# Altium project LED_Controller.PrjPcb
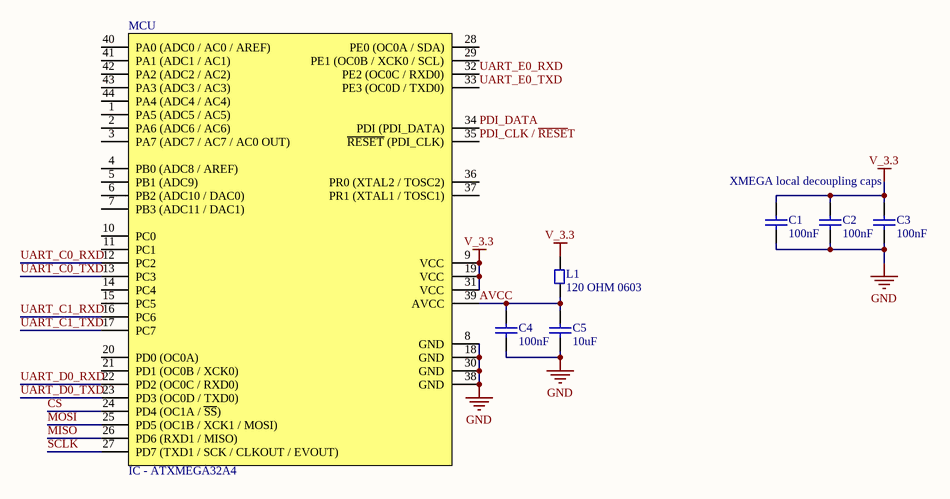
[diagram p0: LED_Controller.SchDoc]
5 sheets, 73 parts. Net scope: global (net labels, ports and power ports of the same name join across sheets).
Board file: LED_Controller.PcbDoc
Sheets:
  LED_Controller.SchDoc
  LED_Controller_Connectors.SchDoc
  LED_Controller_Wireless.SchDoc
  LED_Controller_UART_Multiplexer.SchDoc
  LED_Controller_Power.SchDoc

## Sheet LED_Controller.SchDoc
size A4; Organization: ENEL429 Group N; Address1: ECE Department; Address2: University of Canterbury; Address3: Christchurch 8041; Address4: New Zealand; Revision: 1

### Parts
C1  100nF  [0603]
C2  100nF  [0603]
C3  100nF  [0603]
C4  100nF  [0603]
C5  10uF  [0603]
L1  120 OHM 0603  [0603]
MCU  IC - ATXMEGA32A4  [QFN50P700X700X100-44N]

### Nets
GND: C1.1 C2.1 C3.1 C4.1 C5.1 MCU.8(GND) MCU.18(GND) MCU.30(GND) MCU.38(GND)
V_3.3: C1.2 C2.2 C3.2 L1.2 MCU.9(VCC) MCU.19(VCC) MCU.31(VCC)
AVCC: C4.2 C5.2 L1.1 MCU.39(AVCC)
CS: MCU.24(PD4_(OC1A_/_~{SS}))
MISO: MCU.26(PD6_(RXD1_/_MISO))
MOSI: MCU.25(PD5_(OC1B_/_XCK1_/_MOSI))
PDI_CLK / ~{RESE}T: MCU.35(~{RESET}_(PDI_CLK))
PDI_DATA: MCU.34(PDI_(PDI_DATA))
SCLK: MCU.27(PD7_(TXD1_/_SCK_/_CLKOUT_/_EVOUT))
UART_C0_RXD: MCU.12(PC2)
UART_C0_TXD: MCU.13(PC3)
UART_C1_RXD: MCU.16(PC6)
UART_C1_TXD: MCU.17(PC7)
UART_D0_RXD: MCU.22(PD2_(OC0C_/_RXD0))
UART_D0_TXD: MCU.23(PD3_(OC0D_/_TXD0))
UART_E0_RXD: MCU.32(PE2_(OC0C_/_RXD0))
UART_E0_TXD: MCU.33(PE3_(OC0D_/_TXD0))

Not connected (* = marked no-connect by the designer): MCU 1(PA5_(ADC5_/_AC5)) 2(PA6_(ADC6_/_AC6)) 3(PA7_(ADC7_/_AC7_/_AC0_OUT)) 4(PB0_(ADC8_/_AREF)) 5(PB1_(ADC9)) 6(PB2_(ADC10_/_DAC0)) 7(PB3_(ADC11_/_DAC1)) 10(PC0) 11(PC1) 14(PC4) 15(PC5) 20(PD0_(OC0A)) 21(PD1_(OC0B_/_XCK0)) 28(PE0_(OC0A_/_SDA)) 29(PE1_(OC0B_/_XCK0_/_SCL)) 36(PR0_(XTAL2_/_TOSC2)) 37(PR1_(XTAL1_/_TOSC1)) 40(PA0_(ADC0_/_AC0_/_AREF)) 41(PA1_(ADC1_/_AC1)) 42(PA2_(ADC2_/_AC2)) 43(PA3_(ADC3_/_AC3)) 44(PA4_(ADC4_/_AC4))

### Notes on the sheet
- XMEGA local decoupling caps
- Title
- Drawn by:
- Date:
- Time:
- Revision:
- Sheet
- of
- File:

### Library data of the parts
C1-C4 = CP - 100nF 0603: CAP CER .10UF 50V X5R 0603; Manufacturer: AVX Corporation; Manufacturer Part Number: 06035D104KAT2A; Capacitance: 0.1µF; Tolerance: ±10%; Supplier 1: Digi-Key; RoHS: RoHS Compliant; Category: Capacitors; Stock 1: 0; Pricing 1: 10=0.33, 100=0.195, 500=0.1125, 1000=0.078 (USD); Voltage - Rated: 50V; Temperature Coefficient: X5R; Mounting Type: Surface Mount, MLCC; Operating Temperature: -55°C ~ 85°C; Applications: General Purpose; Ratings: -; Package / Case: 0603 (1608 Metric); Size / Dimension: 0.063" L x 0.032" W (1.60mm x 0.81mm); Height: -; Thickness: 0.035" (0.90mm); Lead Spacing: -; Features: -; Packaging: Cut Tape (CT); Lead Style: -; ComponentLink1URL: http://www.avx.com/docs/Catalogs/cx5r.pdf; ComponentLink1Description: http://www.avx.com/docs/Catalogs/cx5r.pdf; Supplier Part Number 1: 478-6206-1-ND
C5 = CP - 10uF 0603: CAP CER 10000PF 50V X7R 0603; Manufacturer: TDK Corporation; Manufacturer Part Number: C1608X7R1H103M; Tolerance: ±20%; Supplier 1: Digi-Key; RoHS: RoHS Compliant; Category: Capacitors; Stock 1: 7957; Pricing 1: 1=0.08, 10=0.05, 100=0.018, 250=0.013, 500=0.0096, 1000=0.0065 (USD); Capacitance: 10000pF; Voltage - Rated: 50V; Temperature Coefficient: X7R; Mounting Type: Surface Mount, MLCC; Operating Temperature: -55°C ~ 125°C; Applications: General Purpose; Ratings: -; Package / Case: 0603 (1608 Metric); Size / Dimension: 0.063" L x 0.031" W (1.60mm x 0.80mm); Height: -; Thickness: 0.037" (0.95mm); Lead Spacing: -; Features: -; Packaging: Cut Tape (CT); Lead Style: -; ComponentLink1URL: http://www.tdk.com/pdf/general_B11.pdf; ComponentLink1Description: http://www.tdk.com/pdf/general_B11.pdf; Supplier Part Number 1: 445-5090-1-ND
L1 = L - Ferrite Bead 120 Ohm 0603: FERRITE BEAD 120 OHM 0603; Manufacturer: Taiyo Yuden; Manufacturer Part Number: FBMH1608HL121-T; Impedance @ Frequency: 120 Ohm @ 100MHz; Current Rating: 900mA; DC Resistance (DCR): 130 mOhm Max; Filter Type: Differential Mode - Single; Number of Lines: 1; Supplier 1: Digi-Key; RoHS: RoHS Compliant; Category: Filters; Stock 1: 54571; Pricing 1: 1=0.38, 10=0.285, 50=0.1662, 100=0.133, 250=0.095, 500=0.0646, 1000=0.05225 (USD); Package / Case: 0603 (1608 Metric); Mounting Type: Surface Mount; Packaging: Cut Tape (CT); ComponentLink1URL: http://www.yuden.co.jp/us/product/pdf/chipbeads01_e.pdf; ComponentLink1Description: http://www.yuden.co.jp/us/product/pdf/chipbeads01_e.pdf; Supplier Part Number 1: 587-1731-1-ND
MCU = IC - ATXMEGA32A4: MCU AVR 32K FLASH 1.6V 44-QFN; Manufacturer: Atmel; Manufacturer Part Number: ATXMEGA32A4-MH; Core Size: 8/16-Bit; Speed: 32MHz; Connectivity: I²C, IrDA, SPI, UART/USART; Peripherals: Brown-out Detect/Reset, DMA, POR, PWM, WDT; Number of I /O: 34; Program Memory Size: 32KB (16K x 16); EEPROM Size: 2K x 8; RAM Size: 4K x 8; Voltage - Supply (Vcc/Vdd): 1.6 V ~ 3.6 V; Data Converters: A/D 12x12b, D/A 2x12b; Oscillator Type: Internal; Supplier 1: Digi-Key; RoHS: RoHS Compliant; Category: Integrated Circuits (ICs); Stock 1: 8846; Pricing 1: 1=5.88, 25=3.6908, 100=3.2808 (USD); Core Processor: AVR; Program Memory Type: FLASH; Operating Temperature: -40°C ~ 85°C; Package / Case: 44-VFQFN Exposed Pad; Packaging: Tray; ComponentLink1URL: http://www.atmel.com/dyn/resources/prod_documents/doc8069.pdf; ComponentLink1Description: http://www.atmel.com/dyn/resources/prod_documents/doc8069.pdf; Supplier Part Number 1: ATXMEGA32A4-MH-ND

## Sheet LED_Controller_Connectors.SchDoc
size A4; Organization: ENEL429 Group N; Address1: ECE Department; Address2: University of Canterbury; Address3: Christchurch 8041; Address4: New Zealand; Revision: 1
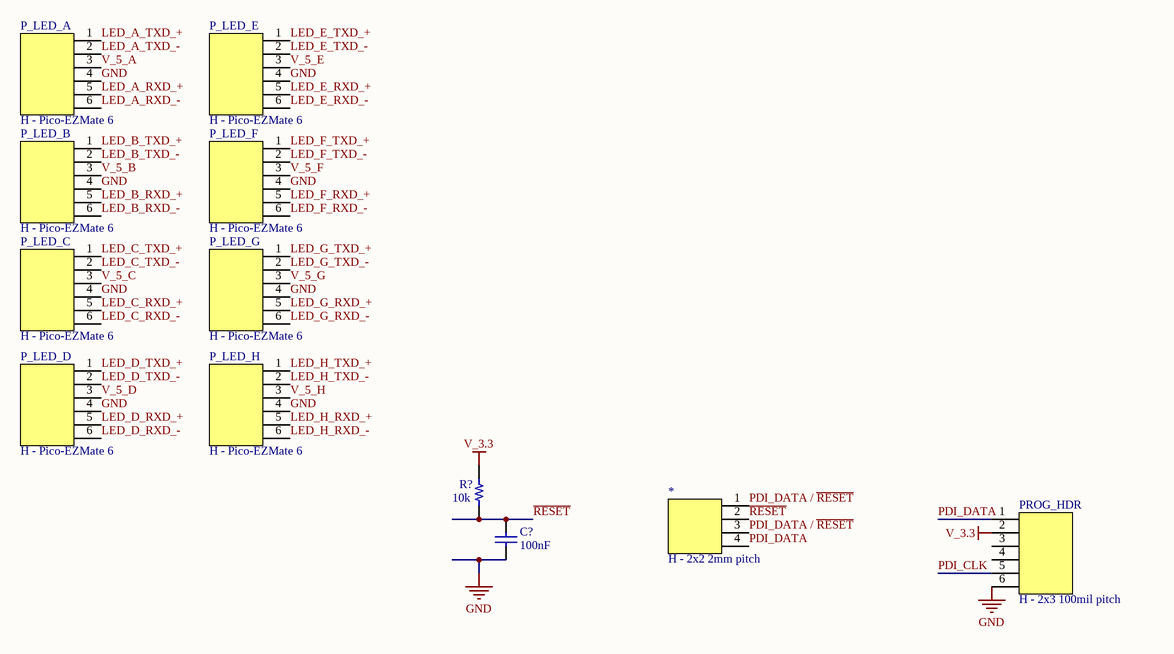
[diagram p1: LED_Controller_Connectors.SchDoc]

### Parts
*  H - 2x2 2mm pitch
C?  100nF  [0603]
P_LED_A  H - Pico-EZMate 6  [Molex - 78171-6006]
P_LED_B  H - Pico-EZMate 6  [Molex - 78171-6006]
P_LED_C  H - Pico-EZMate 6  [Molex - 78171-6006]
P_LED_D  H - Pico-EZMate 6  [Molex - 78171-6006]
P_LED_E  H - Pico-EZMate 6  [Molex - 78171-6006]
P_LED_F  H - Pico-EZMate 6  [Molex - 78171-6006]
P_LED_G  H - Pico-EZMate 6  [Molex - 78171-6006]
P_LED_H  H - Pico-EZMate 6  [Molex - 78171-6006]
PROG_HDR  H - 2x3 100mil pitch  [75869-131LF]
R?  10k  [0603]

### Nets
GND: C?.2 P_LED_A.4 P_LED_B.4 P_LED_C.4 P_LED_D.4 P_LED_E.4 P_LED_F.4 P_LED_G.4 P_LED_H.4 PROG_HDR.6
V_3.3: PROG_HDR.2 R?.2
V_5_A: P_LED_A.3
V_5_B: P_LED_B.3
V_5_C: P_LED_C.3
V_5_D: P_LED_D.3
V_5_E: P_LED_E.3
V_5_F: P_LED_F.3
V_5_G: P_LED_G.3
V_5_H: P_LED_H.3
LED_A_RXD_+: P_LED_A.5
LED_A_RXD_-: P_LED_A.6
LED_A_TXD_+: P_LED_A.1
LED_A_TXD_-: P_LED_A.2
LED_B_RXD_+: P_LED_B.5
LED_B_RXD_-: P_LED_B.6
LED_B_TXD_+: P_LED_B.1
LED_B_TXD_-: P_LED_B.2
LED_C_RXD_+: P_LED_C.5
LED_C_RXD_-: P_LED_C.6
LED_C_TXD_+: P_LED_C.1
LED_C_TXD_-: P_LED_C.2
LED_D_RXD_+: P_LED_D.5
LED_D_RXD_-: P_LED_D.6
LED_D_TXD_+: P_LED_D.1
LED_D_TXD_-: P_LED_D.2
LED_E_RXD_+: P_LED_E.5
LED_E_RXD_-: P_LED_E.6
LED_E_TXD_+: P_LED_E.1
LED_E_TXD_-: P_LED_E.2
LED_F_RXD_+: P_LED_F.5
LED_F_RXD_-: P_LED_F.6
LED_F_TXD_+: P_LED_F.1
LED_F_TXD_-: P_LED_F.2
LED_G_RXD_+: P_LED_G.5
LED_G_RXD_-: P_LED_G.6
LED_G_TXD_+: P_LED_G.1
LED_G_TXD_-: P_LED_G.2
LED_H_RXD_+: P_LED_H.5
LED_H_RXD_-: P_LED_H.6
LED_H_TXD_+: P_LED_H.1
LED_H_TXD_-: P_LED_H.2
PDI_CLK: PROG_HDR.5
PDI_DATA: *.4 PROG_HDR.1
PDI_DATA / ~{RESET}: *.1 *.3
~{RESET}: *.2 C?.1 R?.1

Not connected (* = marked no-connect by the designer): PROG_HDR 3 4

### Notes on the sheet
- Title
- Drawn by:
- Date:
- Time:
- Revision:
- Sheet
- of
- File:

### Library data of the parts
C? = CP - 100nF 0603: as C1 on sheet LED_Controller; Supplier 1: Digi-Key; RoHS: RoHS Compliant; Category: Capacitors; Stock 1: 0; Pricing 1: 10=0.33, 100=0.195, 500=0.1125, 1000=0.078 (USD); Voltage - Rated: 50V; Temperature Coefficient: X5R; Mounting Type: Surface Mount, MLCC; Operating Temperature: -55°C ~ 85°C; Applications: General Purpose; Ratings: -; Package / Case: 0603 (1608 Metric); Size / Dimension: 0.063" L x 0.032" W (1.60mm x 0.81mm); Height: -; Thickness: 0.035" (0.90mm); Lead Spacing: -; Features: -; Packaging: Cut Tape (CT); Lead Style: -; ComponentLink1URL: http://www.avx.com/docs/Catalogs/cx5r.pdf; ComponentLink1Description: http://www.avx.com/docs/Catalogs/cx5r.pdf; Supplier Part Number 1: 478-6206-1-ND
P_LED_A P_LED_B P_LED_C P_LED_D P_LED_E P_LED_F P_LED_G P_LED_H = H - Pico-EZMate 6: CONN HEADER 6POS 1.20MM R/A SMD; Supplier 1: Digi-Key; Supplier Part Number 1: WM5408CT-ND
PROG_HDR = H - 2x3 100mil pitch: CONN HEADER 6POS DUAL VERT PCB; Manufacturer: FCI; Connector Type: Header, Shrouded; Number of Positions: 6; Number of Positions Loaded: All; Pitch: 0.100" (2.54mm); Manufacturer Part Number: 75869-131LF; RoHS: RoHS Compliant; Category: Connectors, Interconnects; Contact Type: Male Pin; Number of Rows: 2; Row Spacing: 0.100" (2.54mm); Contact Mating Length: 0.236" (6.00mm); Mounting Type: Through Hole; Termination: Solder; Fastening Type: -; Features: -; Contact Finish: Gold, GXT™; Contact Finish Thickness: 30µin (0.76µm); Color: Blue; Packaging: Tube; ComponentLink1URL: http://portal.fciconnect.com/res/en/pdffiles/doc_search/75869.pdf; ComponentLink1Description: http://portal.fciconnect.com/res/en/pdffiles/doc_search/75869.pdf; Supplier 1: Digi-Key; Supplier Part Number 1: 609-2845-ND
R? = RS - 10k 0603: RES 10.0K OHM 1/10W 1% 0603 SMD; Manufacturer: Yageo; Manufacturer Part Number: RC0603FR-0710KL; Power (Watts): 0.1W, 1/10W; Temperature Coefficient: ±100ppm/°C; Supplier 1: Digi-Key; RoHS: RoHS Compliant; Category: Resistors; Stock 1: 9813840; Pricing 1: 10=0.014, 50=0.0104, 100=0.0079, 250=0.00584, 500=0.00432, 1000=0.00288 (USD); Resistance (Ohms): 10K; Composition: Thick Film; Features: -; Tolerance: ±1%; Size / Dimension: 0.063" L x 0.031" W (1.60mm x 0.80mm); Height: 0.022" (0.55mm); Number of Terminations: 2; Packaging: Cut Tape (CT); Package / Case: 0603 (1608 Metric); ComponentLink1URL: http://www.yageo.com/documents/recent/PYu-RC0603_51_RoHS_L_4.pdf; ComponentLink1Description: http://www.yageo.com/documents/recent/PYu-RC0603_51_RoHS_L_4.pdf; Supplier Part Number 1: 311-10.0KHRCT-ND
* = H - 2x2 2mm pitch: Supplier 1: Digi-Key; Supplier Part Number 1: WM18712-ND

## Sheet LED_Controller_Wireless.SchDoc
size A4; Organization: ENEL429 Group N; Address1: ECE Department; Address2: University of Canterbury; Address3: Christchurch 8041; Address4: New Zealand; Revision: 1
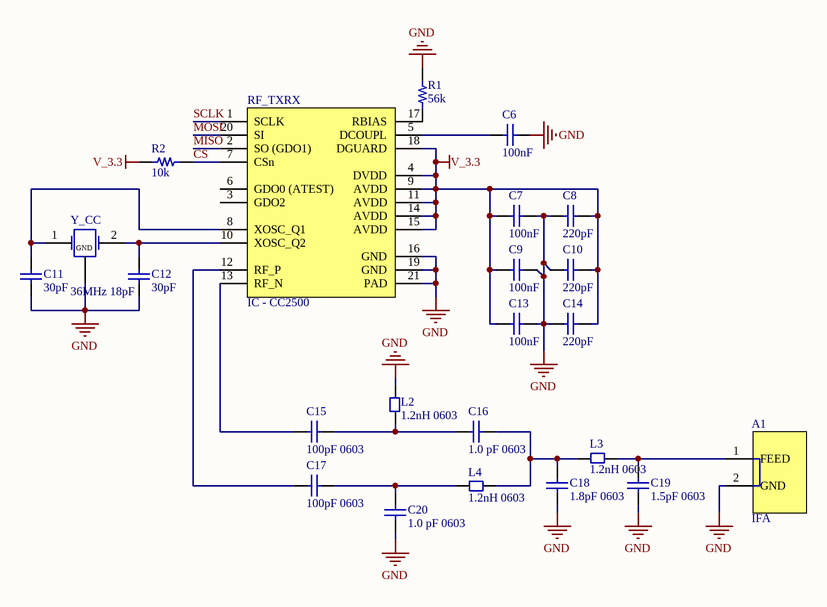
[diagram p2: LED_Controller_Wireless.SchDoc]

### Parts
A1  IFA  [Meandered_Inverted_F_Antenna]
C6  100nF  [0603]
C7  100nF  [0603]
C8  220pF  [0603]
C9  100nF  [0603]
C10  220pF  [0603]
C11  30pF  [0603]
C12  30pF  [0603]
C13  100nF  [0603]
C14  220pF  [0603]
C15  100pF 0603  [0603]
C16  1.0 pF 0603  [0603]
C17  100pF 0603  [0603]
C18  1.8pF 0603  [0603]
C19  1.5pF 0603  [0603]
C20  1.0 pF 0603  [0603]
L2  1.2nH 0603  [0603]
L3  1.2nH 0603  [0603]
L4  1.2nH 0603  [0603]
R1  56k  [0603]
R2  10k  [0603]
RF_TXRX  IC - CC2500  [TI - RTK / QFN50P400X400X90-20N]
Y_CC  36MHz 18pF  [7M-36.000MAAJ-T]

### Nets
GND: A1.2(GND) C6.2 C7.1 C8.1 C9.1 C10.1 C11.1 C12.1 C13.1 C14.1 C18.1 C19.1 C20.1 L2.2 R1.2 RF_TXRX.16(GND) RF_TXRX.19(GND) RF_TXRX.21(PAD) Y_CC.3(GND)
V_3.3: C7.2 C8.2 C9.2 C10.2 C13.2 C14.2 R2.2 RF_TXRX.4(DVDD) RF_TXRX.9(AVDD) RF_TXRX.11(AVDD) RF_TXRX.14(AVDD) RF_TXRX.15(AVDD) RF_TXRX.18(DGUARD)
CS: R2.1 RF_TXRX.7(CSn)
MISO: RF_TXRX.2(SO_(GDO1))
MOSI: RF_TXRX.20(SI)
SCLK: RF_TXRX.1(SCLK)
NetA1_1: A1.1(FEED) C19.2 L3.2
NetC6_1: C6.1 RF_TXRX.5(DCOUPL)
NetC11_2: C11.2 RF_TXRX.8(XOSC_Q1) Y_CC.1
NetC12_2: C12.2 RF_TXRX.10(XOSC_Q2) Y_CC.2
NetC15_1: C15.1 RF_TXRX.13(RF_N)
NetC15_2: C15.2 C16.1 L2.1
NetC16_2: C16.2 C18.2 L3.1 L4.1
NetC17_1: C17.1 RF_TXRX.12(RF_P)
NetC17_2: C17.2 C20.2 L4.2
NetR1_1: R1.1 RF_TXRX.17(RBIAS)

Not connected (* = marked no-connect by the designer): RF_TXRX 3(GDO2) 6(GDO0_(ATEST))

### Notes on the sheet
- Title
- Drawn by:
- Date:
- Time:
- Revision:
- Sheet
- of
- File:

### Library data of the parts
A1 = Meandered_Inverted_F_Antenna
C6 C7 C9 C13 = CP - 100nF 0603: as C1 on sheet LED_Controller; Supplier 1: Digi-Key; Supplier Part Number 1: 478-6206-1-ND; RoHS: RoHS Compliant; Category: Capacitors; Stock 1: 0; Pricing 1: 10=0.33, 100=0.195, 500=0.1125, 1000=0.078 (USD); Voltage - Rated: 50V; Temperature Coefficient: X5R; Mounting Type: Surface Mount, MLCC; Operating Temperature: -55°C ~ 85°C; Applications: General Purpose; Ratings: -; Package / Case: 0603 (1608 Metric); Size / Dimension: 0.063" L x 0.032" W (1.60mm x 0.81mm); Height: -; Thickness: 0.035" (0.90mm); Lead Spacing: -; Features: -; Packaging: Cut Tape (CT); Lead Style: -; ComponentLink1URL: http://www.avx.com/docs/Catalogs/cx5r.pdf; ComponentLink1Description: http://www.avx.com/docs/Catalogs/cx5r.pdf
C8 C10 C14 = CP - 220pF 0603: CAP CER 220PF 50V NP0 0603; Manufacturer: Johanson Dielectrics Inc; Manufacturer Part Number: 500R14N221JV4T; Tolerance: ±5%; Temperature Coefficient: C0G, NP0; Supplier 1: Digi-Key; RoHS: RoHS Compliant; Category: Capacitors; Stock 1: 21369; Pricing 1: 10=0.047, 100=0.028, 500=0.01612, 1000=0.01118 (USD); Capacitance: 220pF; Voltage - Rated: 50V; Mounting Type: Surface Mount, MLCC; Operating Temperature: -55°C ~ 125°C; Applications: General Purpose; Ratings: -; Package / Case: 0603 (1608 Metric); Size / Dimension: 0.063" L x 0.032" W (1.60mm x 0.81mm); Height: -; Thickness: 0.035" (0.89mm); Lead Spacing: -; Features: -; Packaging: Cut Tape (CT); Lead Style: -; ComponentLink1URL: http://www.johansondielectrics.com/images/stories/surface-mount/smt-mlc/JDI_Surface-Mount_2008-11.pdf; ComponentLink1Description: http://www.johansondielectrics.com/images/stories/surface-mount/smt-mlc/JDI_Surface-Mount_2008-11.pdf; Supplier Part Number 1: 709-1148-1-ND
C11 C12 = CP - 30pF 0603: CAP CER 30PF 50V C0G 0603; Manufacturer: TDK Corporation; Manufacturer Part Number: C1608C0G1H300J; Tolerance: ±5%; Temperature Coefficient: C0G, NP0; Supplier 1: Digi-Key; RoHS: RoHS Compliant; Category: Capacitors; Stock 1: 25238; Pricing 1: 1=0.13, 10=0.083, 100=0.0297, 250=0.02144, 500=0.01584, 1000=0.01073 (USD); Capacitance: 30pF; Voltage - Rated: 50V; Mounting Type: Surface Mount, MLCC; Operating Temperature: -55°C ~ 125°C; Applications: General Purpose; Ratings: -; Package / Case: 0603 (1608 Metric); Size / Dimension: 0.063" L x 0.031" W (1.60mm x 0.80mm); Height: -; Thickness: 0.037" (0.95mm); Lead Spacing: -; Features: -; Packaging: Cut Tape (CT); Lead Style: -; ComponentLink1URL: http://www.tdk.com/pdf/general_B11.pdf; ComponentLink1Description: http://www.tdk.com/pdf/general_B11.pdf; Supplier Part Number 1: 445-5054-1-ND
C15 C17 = CP - 100pF 0603: CAP CERM 100PF 5% 50V NP0 0603; Manufacturer: AVX Corporation; Manufacturer Part Number: 06035A101JAT2A; Temperature Coefficient: C0G, NP0; Supplier 1: Digi-Key; RoHS: RoHS Compliant; Category: Capacitors; Stock 1: 1724543; Pricing 1: 10=0.028, 100=0.0163, 500=0.00938, 1000=0.0065 (USD); Capacitance: 100pF; Voltage - Rated: 50V; Tolerance: ±5%; Mounting Type: Surface Mount, MLCC; Operating Temperature: -55°C ~ 125°C; Applications: General Purpose; Ratings: -; Package / Case: 0603 (1608 Metric); Size / Dimension: 0.063" L x 0.032" W (1.60mm x 0.81mm); Height: -; Thickness: 0.035" (0.90mm); Lead Spacing: -; Features: -; Packaging: Cut Tape (CT); Lead Style: -; ComponentLink1URL: http://www.avx.com/docs/Catalogs/ccog.pdf; ComponentLink1Description: http://www.avx.com/docs/Catalogs/ccog.pdf; Supplier Part Number 1: 478-1175-1-ND
C16 C20 = CP - 1.0pF 0603: CAP CER 1.0PF 50V C0G 0603; Manufacturer: TDK Corporation; Manufacturer Part Number: C1608C0G1H010C; Tolerance: ±0.25pF; Temperature Coefficient: C0G, NP0; Supplier 1: Digi-Key; RoHS: RoHS Compliant; Category: Capacitors; Stock 1: 89185; Pricing 1: 1=0.09, 10=0.058, 100=0.0207, 250=0.01496, 500=0.01104, 1000=0.00748 (USD); Capacitance: 1.0pF; Voltage - Rated: 50V; Mounting Type: Surface Mount, MLCC; Operating Temperature: -55°C ~ 125°C; Applications: General Purpose; Ratings: -; Package / Case: 0603 (1608 Metric); Size / Dimension: 0.063" L x 0.031" W (1.60mm x 0.80mm); Height: -; Thickness: 0.037" (0.95mm); Lead Spacing: -; Features: -; Packaging: Cut Tape (CT); Lead Style: -; ComponentLink1URL: http://www.tdk.com/pdf/general_B11.pdf; ComponentLink1Description: http://www.tdk.com/pdf/general_B11.pdf; Supplier Part Number 1: 445-5009-1-ND
C18 = CP - 1.8pF 0603: CAP CER 1.8PF 50V C0G 0603; Manufacturer: TDK Corporation; Manufacturer Part Number: C1608C0G1H1R8C; Tolerance: ±0.25pF; Temperature Coefficient: C0G, NP0; Supplier 1: Digi-Key; RoHS: RoHS Compliant; Category: Capacitors; Stock 1: 2092; Pricing 1: 1=0.12, 10=0.075, 100=0.027, 250=0.01952, 500=0.0144, 1000=0.00975 (USD); Capacitance: 1.8pF; Voltage - Rated: 50V; Mounting Type: Surface Mount, MLCC; Operating Temperature: -55°C ~ 125°C; Applications: General Purpose; Ratings: -; Package / Case: 0603 (1608 Metric); Size / Dimension: 0.063" L x 0.031" W (1.60mm x 0.80mm); Height: -; Thickness: 0.037" (0.95mm); Lead Spacing: -; Features: -; Packaging: Cut Tape (CT); Lead Style: -; ComponentLink1URL: http://www.tdk.com/pdf/general_B11.pdf; ComponentLink1Description: http://www.tdk.com/pdf/general_B11.pdf; Supplier Part Number 1: 445-5015-1-ND
C19 = CP - 1.5pF 0603: CAP CER 1.5PF 50V C0G 0603; Manufacturer: TDK Corporation; Manufacturer Part Number: C1608C0G1H1R5C; Tolerance: ±0.25pF; Temperature Coefficient: C0G, NP0; Supplier 1: Digi-Key; RoHS: RoHS Compliant; Category: Capacitors; Stock 1: 31690; Pricing 1: 1=0.09, 10=0.058, 100=0.0207, 250=0.01496, 500=0.01104, 1000=0.00748 (USD); Capacitance: 1.5pF; Voltage - Rated: 50V; Mounting Type: Surface Mount, MLCC; Operating Temperature: -55°C ~ 125°C; Applications: General Purpose; Ratings: -; Package / Case: 0603 (1608 Metric); Size / Dimension: 0.063" L x 0.031" W (1.60mm x 0.80mm); Height: -; Thickness: 0.037" (0.95mm); Lead Spacing: -; Features: -; Packaging: Cut Tape (CT); Lead Style: -; ComponentLink1URL: http://www.tdk.com/pdf/general_B11.pdf; ComponentLink1Description: http://www.tdk.com/pdf/general_B11.pdf; Supplier Part Number 1: 445-5013-1-ND
L2-L4 = L - 1.2nH 0603: INDUCTOR HI FREQ 1.2+/-0.3NH; Manufacturer: Taiyo Yuden; Manufacturer Part Number: HK16081N2S-T; Current: 300mA; Type: Ceramic; Tolerance: ±0.3nH; DC Resistance (DCR): 50 mOhm Max; Q @ Freq: 8 @ 100MHz; Self Resonant Freq: 10GHz; Frequency - Test: 100MHz; Supplier 1: Digi-Key; RoHS: RoHS Compliant; Category: Inductors, Coils, Chokes; Stock 1: 35758; Pricing 1: 1=0.07, 10=0.064, 50=0.06, 100=0.056, 500=0.044, 1000=0.036 (USD); Inductance: 1.2nH; Current - Saturation: -; Current - Temperature Rise: -; Shielding: -; Package / Case: 0603 (1608 Metric); Mounting Type: Surface Mount; Packaging: Cut Tape (CT); Operating Temperature: -40°C ~ 85°C; Material - Core: -; Applications: General Purpose; ComponentLink1URL: http://www.yuden.co.jp/ut/product/pdf/mlci04_e.pdf; ComponentLink1Description: http://www.yuden.co.jp/ut/product/pdf/mlci04_e.pdf; Supplier Part Number 1: 587-1534-1-ND
R1 = RS - 56k 0603: RES 56K OHM 1/10W 5% 0603 SMD; Manufacturer: Yageo; Manufacturer Part Number: RC0603JR-0756KL; Power (Watts): 0.1W, 1/10W; Temperature Coefficient: ±100ppm/°C; Supplier 1: Digi-Key; Supplier Part Number 1: 311-56KGRCT-ND; RoHS: RoHS Compliant; Category: Resistors; Stock 1: 236462; Pricing 1: 10=0.01, 50=0.008, 100=0.006, 250=0.00448, 500=0.00332, 1000=0.00221 (USD); Resistance (Ohms): 56K; Composition: Thick Film; Features: -; Tolerance: ±5%; Size / Dimension: 0.063" L x 0.031" W (1.60mm x 0.80mm); Height: 0.022" (0.55mm); Number of Terminations: 2; Packaging: Cut Tape (CT); Package / Case: 0603 (1608 Metric); ComponentLink1URL: http://www.yageo.com/documents/recent/PYu-RC0603_51_RoHS_L_4.pdf; ComponentLink1Description: http://www.yageo.com/documents/recent/PYu-RC0603_51_RoHS_L_4.pdf
R2 = RS - 10k 0603: as R? on sheet LED_Controller_Connectors; Supplier 1: Digi-Key; Supplier Part Number 1: 311-10.0KHRCT-ND; RoHS: RoHS Compliant; Category: Resistors; Stock 1: 9813840; Pricing 1: 10=0.014, 50=0.0104, 100=0.0079, 250=0.00584, 500=0.00432, 1000=0.00288 (USD); Resistance (Ohms): 10K; Composition: Thick Film; Features: -; Tolerance: ±1%; Size / Dimension: 0.063" L x 0.031" W (1.60mm x 0.80mm); Height: 0.022" (0.55mm); Number of Terminations: 2; Packaging: Cut Tape (CT); Package / Case: 0603 (1608 Metric); ComponentLink1URL: http://www.yageo.com/documents/recent/PYu-RC0603_51_RoHS_L_4.pdf; ComponentLink1Description: http://www.yageo.com/documents/recent/PYu-RC0603_51_RoHS_L_4.pdf
RF_TXRX = IC - CC2500: IC RF TXRX SNGL-CHIP LP 20-QFN; Manufacturer: Texas Instruments; Manufacturer Part Number: CC2500RTKR; Frequency: 2.4GHz; Data Rate - Maximum: 500kBaud; Modulation or Protocol: 2-FSK, ASK, GFSK, MSK, OOK; Power - Output: -30dBm ~ 10dBm; Sensitivity: -104dBm; Voltage - Supply: 1.8 V ~ 3.6 V; Current - Receiving: 17mA; Current - Transmitting: 21.5mA @ 1 dBm; Data Interface: PCB, Surface Mount; Supplier 1: Digi-Key; RoHS: RoHS Compliant; Category: RF/IF and RFID; Stock 1: 20005; Pricing 1: 1=4.2, 25=3.43, 100=3.08, 250=2.8, 500=2.45, 1000=2.1 (USD); Applications: ISM, SRD; Memory Size: -; Antenna Connector: PCB, Surface Mount; Operating Temperature: -40°C ~ 85°C; Package / Case: 20-VQFN Exposed Pad, 20-HVQFN, 20-SQFN, 20-DHVQFN; Packaging: Cut Tape (CT); ComponentLink1URL: http://focus.ti.com/lit/ds/symlink/cc2500.pdf; ComponentLink1Description: http://focus.ti.com/lit/ds/symlink/cc2500.pdf; Supplier Part Number 1: 296-19586-1-ND
Y_CC = X - 36MHz 18pF: CRYSTAL 36.000 MHZ 18PF SMD; Manufacturer: TXC CORPORATION; Frequency Stability: ±30ppm; Operating Mode: Fundamental; Supplier 1: Digi-Key; Manufacturer Part Number: 7M-36.000MAAJ-T; RoHS: RoHS Compliant; Category: Crystals and Oscillators; Stock 1: 5817; Pricing 1: 1=1.31, 10=1.138, 50=0.9976, 100=0.7875, 500=0.665, 1000=0.525 (USD); Type: MHz Crystal; Frequency: 36MHz; Frequency Tolerance: ±30ppm; Load Capacitance: 18pF; Operating Temperature: -20°C ~ 70°C; Mounting Type: Surface Mount; Package / Case: 4-SMD, No Lead (DFN, LCC); Size / Dimension: 0.126" L x 0.098" W (3.20mm x 2.50mm); Height: 0.031" (0.80mm); Packaging: Cut Tape (CT); ComponentLink1URL: http://www.txccrystal.com/images/pdf/7m.pdf; ComponentLink1Description: http://www.txccrystal.com/images/pdf/7m.pdf; Supplier Part Number 1: 887-1137-1-ND

## Sheet LED_Controller_UART_Multiplexer.SchDoc
size A4
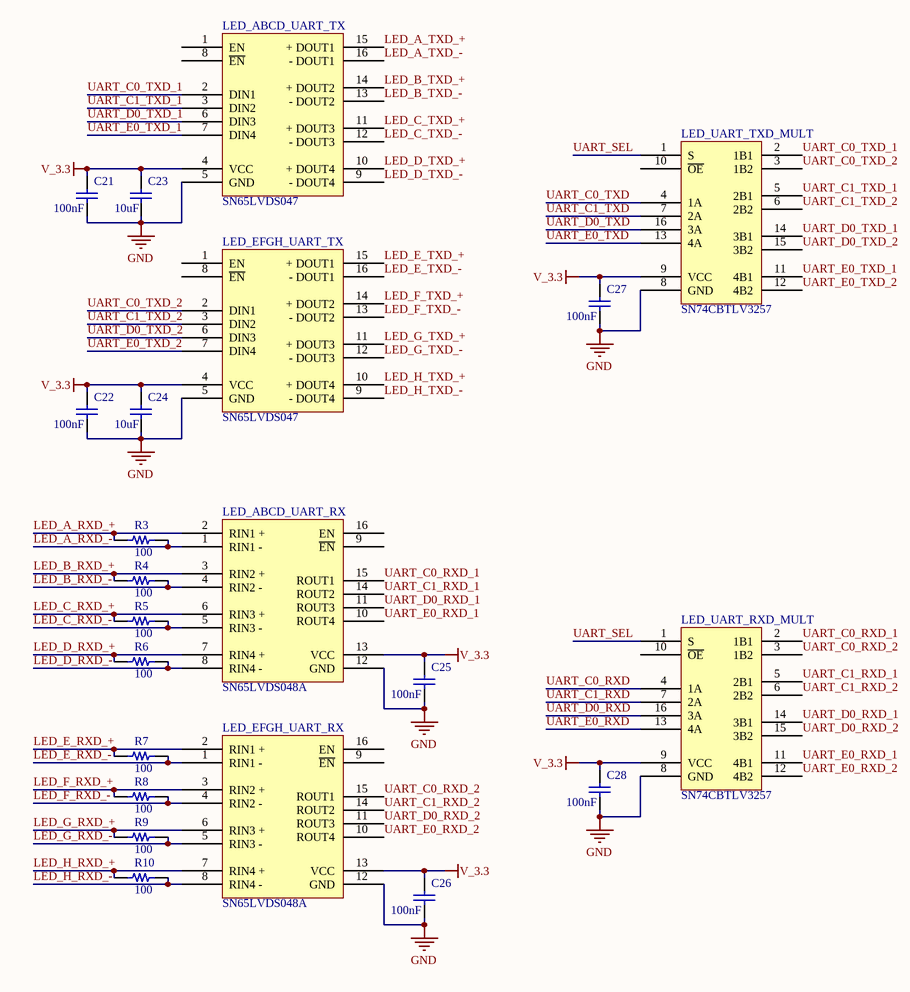
[diagram p3: LED_Controller_UART_Multiplexer.SchDoc]

### Parts
C21  100nF  [0603]
C22  100nF  [0603]
C23  10uF  [0603]
C24  10uF  [0603]
C25  100nF  [0603]
C26  100nF  [0603]
C27  100nF  [0603]
C28  100nF  [0603]
LED_ABCD_UART_RX  SN65LVDS048A  [TI - PW / TSOP65P640X120-16N]
LED_ABCD_UART_TX  SN65LVDS047  [TI - PW / TSOP65P640X120-16N]
LED_EFGH_UART_RX  SN65LVDS048A  [TI - PW / TSOP65P640X120-16N]
LED_EFGH_UART_TX  SN65LVDS047  [TI - PW / TSOP65P640X120-16N]
LED_UART_RXD_MULT  SN74CBTLV3257  [TI - DGV16 / TSSOP40P640X120-16N]
LED_UART_TXD_MULT  SN74CBTLV3257  [TI - DGV16 / TSSOP40P640X120-16N]
R3  100  [0603]
R4  100  [0603]
R5  100  [0603]
R6  100  [0603]
R7  100  [0603]
R8  100  [0603]
R9  100  [0603]
R10  100  [0603]

### Nets
GND: C21.1 C22.1 C23.1 C24.1 C25.1 C26.1 C27.1 C28.1 LED_ABCD_UART_RX.12(GND) LED_ABCD_UART_TX.5(GND) LED_EFGH_UART_RX.12(GND) LED_EFGH_UART_TX.5(GND) LED_UART_RXD_MULT.8(GND) LED_UART_TXD_MULT.8(GND)
V_3.3: C21.2 C22.2 C23.2 C24.2 C25.2 C26.2 C27.2 C28.2 LED_ABCD_UART_RX.13(VCC) LED_ABCD_UART_TX.4(VCC) LED_EFGH_UART_RX.13(VCC) LED_EFGH_UART_TX.4(VCC) LED_UART_RXD_MULT.9(VCC) LED_UART_TXD_MULT.9(VCC)
LED_A_RXD_+: LED_ABCD_UART_RX.2(RIN1_+) R3.1
LED_A_RXD_-: LED_ABCD_UART_RX.1(RIN1_-) R3.2
LED_A_TXD_+: LED_ABCD_UART_TX.15(+_DOUT1)
LED_A_TXD_-: LED_ABCD_UART_TX.16(-_DOUT1)
LED_B_RXD_+: LED_ABCD_UART_RX.3(RIN2_+) R4.1
LED_B_RXD_-: LED_ABCD_UART_RX.4(RIN2_-) R4.2
LED_B_TXD_+: LED_ABCD_UART_TX.14(+_DOUT2)
LED_B_TXD_-: LED_ABCD_UART_TX.13(-_DOUT2)
LED_C_RXD_+: LED_ABCD_UART_RX.6(RIN3_+) R5.1
LED_C_RXD_-: LED_ABCD_UART_RX.5(RIN3_-) R5.2
LED_C_TXD_+: LED_ABCD_UART_TX.11(+_DOUT3)
LED_C_TXD_-: LED_ABCD_UART_TX.12(-_DOUT3)
LED_D_RXD_+: LED_ABCD_UART_RX.7(RIN4_+) R6.1
LED_D_RXD_-: LED_ABCD_UART_RX.8(RIN4_-) R6.2
LED_D_TXD_+: LED_ABCD_UART_TX.10(+_DOUT4)
LED_D_TXD_-: LED_ABCD_UART_TX.9(-_DOUT4)
LED_E_RXD_+: LED_EFGH_UART_RX.2(RIN1_+) R7.1
LED_E_RXD_-: LED_EFGH_UART_RX.1(RIN1_-) R7.2
LED_E_TXD_+: LED_EFGH_UART_TX.15(+_DOUT1)
LED_E_TXD_-: LED_EFGH_UART_TX.16(-_DOUT1)
LED_F_RXD_+: LED_EFGH_UART_RX.3(RIN2_+) R8.1
LED_F_RXD_-: LED_EFGH_UART_RX.4(RIN2_-) R8.2
LED_F_TXD_+: LED_EFGH_UART_TX.14(+_DOUT2)
LED_F_TXD_-: LED_EFGH_UART_TX.13(-_DOUT2)
LED_G_RXD_+: LED_EFGH_UART_RX.6(RIN3_+) R9.1
LED_G_RXD_-: LED_EFGH_UART_RX.5(RIN3_-) R9.2
LED_G_TXD_+: LED_EFGH_UART_TX.11(+_DOUT3)
LED_G_TXD_-: LED_EFGH_UART_TX.12(-_DOUT3)
LED_H_RXD_+: LED_EFGH_UART_RX.7(RIN4_+) R10.1
LED_H_RXD_-: LED_EFGH_UART_RX.8(RIN4_-) R10.2
LED_H_TXD_+: LED_EFGH_UART_TX.10(+_DOUT4)
LED_H_TXD_-: LED_EFGH_UART_TX.9(-_DOUT4)
UART_C0_RXD: LED_UART_RXD_MULT.4(1A)
UART_C0_RXD_1: LED_ABCD_UART_RX.15(ROUT1) LED_UART_RXD_MULT.2(1B1)
UART_C0_RXD_2: LED_EFGH_UART_RX.15(ROUT1) LED_UART_RXD_MULT.3(1B2)
UART_C0_TXD: LED_UART_TXD_MULT.4(1A)
UART_C0_TXD_1: LED_ABCD_UART_TX.2(DIN1) LED_UART_TXD_MULT.2(1B1)
UART_C0_TXD_2: LED_EFGH_UART_TX.2(DIN1) LED_UART_TXD_MULT.3(1B2)
UART_C1_RXD: LED_UART_RXD_MULT.7(2A)
UART_C1_RXD_1: LED_ABCD_UART_RX.14(ROUT2) LED_UART_RXD_MULT.5(2B1)
UART_C1_RXD_2: LED_EFGH_UART_RX.14(ROUT2) LED_UART_RXD_MULT.6(2B2)
UART_C1_TXD: LED_UART_TXD_MULT.7(2A)
UART_C1_TXD_1: LED_ABCD_UART_TX.3(DIN2) LED_UART_TXD_MULT.5(2B1)
UART_C1_TXD_2: LED_EFGH_UART_TX.3(DIN2) LED_UART_TXD_MULT.6(2B2)
UART_D0_RXD: LED_UART_RXD_MULT.16(3A)
UART_D0_RXD_1: LED_ABCD_UART_RX.11(ROUT3) LED_UART_RXD_MULT.14(3B1)
UART_D0_RXD_2: LED_EFGH_UART_RX.11(ROUT3) LED_UART_RXD_MULT.15(3B2)
UART_D0_TXD: LED_UART_TXD_MULT.16(3A)
UART_D0_TXD_1: LED_ABCD_UART_TX.6(DIN3) LED_UART_TXD_MULT.14(3B1)
UART_D0_TXD_2: LED_EFGH_UART_TX.6(DIN3) LED_UART_TXD_MULT.15(3B2)
UART_E0_RXD: LED_UART_RXD_MULT.13(4A)
UART_E0_RXD_1: LED_ABCD_UART_RX.10(ROUT4) LED_UART_RXD_MULT.11(4B1)
UART_E0_RXD_2: LED_EFGH_UART_RX.10(ROUT4) LED_UART_RXD_MULT.12(4B2)
UART_E0_TXD: LED_UART_TXD_MULT.13(4A)
UART_E0_TXD_1: LED_ABCD_UART_TX.7(DIN4) LED_UART_TXD_MULT.11(4B1)
UART_E0_TXD_2: LED_EFGH_UART_TX.7(DIN4) LED_UART_TXD_MULT.12(4B2)
UART_SEL: LED_UART_RXD_MULT.1(S) LED_UART_TXD_MULT.1(S)

Not connected (* = marked no-connect by the designer): LED_ABCD_UART_RX 9(~{EN}) 16(EN); LED_ABCD_UART_TX 1(EN) 8(~{EN}); LED_EFGH_UART_RX 9(~{EN}) 16(EN); LED_EFGH_UART_TX 1(EN) 8(~{EN}); LED_UART_RXD_MULT 10(~{OE}); LED_UART_TXD_MULT 10(~{OE})

### Library data of the parts
C21 C22 C25-C28 = CP - 100nF 0603: as C1 on sheet LED_Controller; Supplier 1: Digi-Key; RoHS: RoHS Compliant; Category: Capacitors; Stock 1: 0; Pricing 1: 10=0.33, 100=0.195, 500=0.1125, 1000=0.078 (USD); Voltage - Rated: 50V; Temperature Coefficient: X5R; Mounting Type: Surface Mount, MLCC; Operating Temperature: -55°C ~ 85°C; Applications: General Purpose; Ratings: -; Package / Case: 0603 (1608 Metric); Size / Dimension: 0.063" L x 0.032" W (1.60mm x 0.81mm); Height: -; Thickness: 0.035" (0.90mm); Lead Spacing: -; Features: -; Packaging: Cut Tape (CT); Lead Style: -; ComponentLink1URL: http://www.avx.com/docs/Catalogs/cx5r.pdf; ComponentLink1Description: http://www.avx.com/docs/Catalogs/cx5r.pdf; Supplier Part Number 1: 478-6206-1-ND
C23 C24 = CP - 10uF 0603: as C5 on sheet LED_Controller; Supplier 1: Digi-Key; RoHS: RoHS Compliant; Category: Capacitors; Stock 1: 7957; Pricing 1: 1=0.08, 10=0.05, 100=0.018, 250=0.013, 500=0.0096, 1000=0.0065 (USD); Capacitance: 10000pF; Voltage - Rated: 50V; Temperature Coefficient: X7R; Mounting Type: Surface Mount, MLCC; Operating Temperature: -55°C ~ 125°C; Applications: General Purpose; Ratings: -; Package / Case: 0603 (1608 Metric); Size / Dimension: 0.063" L x 0.031" W (1.60mm x 0.80mm); Height: -; Thickness: 0.037" (0.95mm); Lead Spacing: -; Features: -; Packaging: Cut Tape (CT); Lead Style: -; ComponentLink1URL: http://www.tdk.com/pdf/general_B11.pdf; ComponentLink1Description: http://www.tdk.com/pdf/general_B11.pdf; Supplier Part Number 1: 445-5090-1-ND
LED_ABCD_UART_RX LED_EFGH_UART_RX = IC - SN65LVDS048A: LVDS QUAD DIFFERENTIAL LINE RECEIVER; Supplier 1: Digi-Key; Supplier Part Number 1: 296-6912-5-ND
LED_ABCD_UART_TX LED_EFGH_UART_TX = IC - SN65LVDS047: IC LVDS QUAD LINE DRIVER; Supplier 1: Digi-Key; Supplier Part Number 1: 296-6910-5-ND
LED_UART_RXD_MULT LED_UART_TXD_MULT = IC - SN74CBTLV3257: Low-Voltage 4-Bit 1-of-2 FET Multiplexer/Demultiplexer; Supplier 1: Digi-Key; Supplier Part Number 1: 296-9136-1-ND
R3-R10 = RS - 100 0603: RES 100 OHM 1/10W 1% 0603 SMD; Supplier 1: Digi-Key; Supplier Part Number 1: RMCF0603FT100RCT-ND

## Sheet LED_Controller_Power.SchDoc
size A4
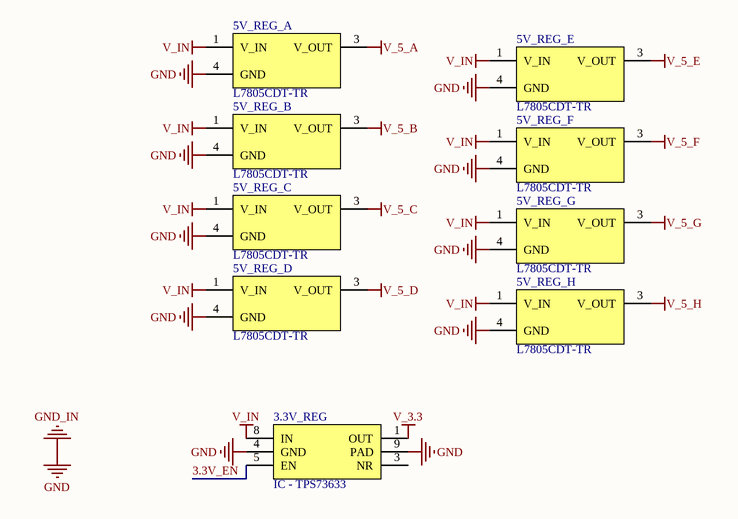
[diagram p4: LED_Controller_Power.SchDoc]

### Parts
3.3V_REG  IC - TPS73633  [TI - DRB / QFN65P300X300X100-8L]
5V_REG_A  L7805CDT-TR  [TO228P973X240-3N]
5V_REG_B  L7805CDT-TR  [TO228P973X240-3N]
5V_REG_C  L7805CDT-TR  [TO228P973X240-3N]
5V_REG_D  L7805CDT-TR  [TO228P973X240-3N]
5V_REG_E  L7805CDT-TR  [TO228P973X240-3N]
5V_REG_F  L7805CDT-TR  [TO228P973X240-3N]
5V_REG_G  L7805CDT-TR  [TO228P973X240-3N]
5V_REG_H  L7805CDT-TR  [TO228P973X240-3N]

### Nets
GND: 3.3V_REG.4(GND) 3.3V_REG.9(PAD) 5V_REG_A.4(GND) 5V_REG_B.4(GND) 5V_REG_C.4(GND) 5V_REG_D.4(GND) 5V_REG_E.4(GND) 5V_REG_F.4(GND) 5V_REG_G.4(GND) 5V_REG_H.4(GND)  [also labelled GND_IN]
V_3.3: 3.3V_REG.1(OUT)
V_5_A: 5V_REG_A.3(V_OUT)
V_5_B: 5V_REG_B.3(V_OUT)
V_5_C: 5V_REG_C.3(V_OUT)
V_5_D: 5V_REG_D.3(V_OUT)
V_5_E: 5V_REG_E.3(V_OUT)
V_5_F: 5V_REG_F.3(V_OUT)
V_5_G: 5V_REG_G.3(V_OUT)
V_5_H: 5V_REG_H.3(V_OUT)
V_IN: 3.3V_REG.8(IN) 5V_REG_A.1(V_IN) 5V_REG_B.1(V_IN) 5V_REG_C.1(V_IN) 5V_REG_D.1(V_IN) 5V_REG_E.1(V_IN) 5V_REG_F.1(V_IN) 5V_REG_G.1(V_IN) 5V_REG_H.1(V_IN)
3.3V_EN: 3.3V_REG.5(EN)

Not connected (* = marked no-connect by the designer): 3.3V_REG 3(NR)

### Library data of the parts
3.3V_REG = IC - TPS73633: IC LDO REG 400MA NO CAP 8-SON; Manufacturer: Texas Instruments; Manufacturer Part Number: TPS73633DRBR; Regulator Topology: Positive Fixed; Voltage - Output: 3.3V; Voltage - Input: Up to 5.5V; Voltage - Dropout (Typical): 0.075V @ 400mA; Number of Regulators: 1; Current - Output: 400mA (Max); Supplier 1: Digi-Key; RoHS: RoHS Compliant; Category: Integrated Circuits (ICs); Stock 1: 6005; Pricing 1: 1=3.15, 25=2.43, 100=2.205, 250=1.98, 500=1.71, 1000=1.44 (USD); Current - Limit (Min): 400mA; Operating Temperature: -40°C ~ 125°C; Mounting Type: Surface Mount; Package / Case: 8-VDFN Exposed Pad; Supplier Device Package: 8-SON Exposed Pad (3x3); Packaging: Cut Tape (CT); ComponentLink1URL: http://focus.ti.com/lit/ds/symlink/tps73601.pdf; ComponentLink1Description: http://focus.ti.com/lit/ds/symlink/tps73601.pdf; Supplier Part Number 1: 296-17884-1-ND
5V_REG_A 5V_REG_B 5V_REG_C 5V_REG_D 5V_REG_E 5V_REG_F 5V_REG_G 5V_REG_H = IC - L7805CDT-TR: IC REG POS 1.5A 5V PREC DPAK; Manufacturer: STMicroelectronics; Regulator Topology: Positive Fixed; Voltage - Input: Up to 35V; Voltage - Dropout (Typical): 2V @ 1A; Number of Regulators: 1; Supplier 1: Digi-Key; Manufacturer Part Number: L7805CDT-TR; RoHS: RoHS Compliant; Category: Integrated Circuits (ICs); Stock 1: 149311; Pricing 1: 1=0.91, 10=0.783, 100=0.618, 250=0.5356, 500=0.4532, 1000=0.3605 (USD); Voltage - Output: 5V; Current - Output: 1.5A; Current - Limit (Min): -; Operating Temperature: 0°C ~ 125°C; Mounting Type: Surface Mount; Package / Case: TO-252-3, DPak (2 Leads + Tab), SC-63; Supplier Device Package: D-Pak; Packaging: Cut Tape (CT); ComponentLink1URL: http://www.st.com/internet/com/TECHNICAL_RESOURCES/TECHNICAL_LITERATURE/DATASHEET/CD00000444.pdf; ComponentLink1Description: http://www.st.com/internet/com/TECHNICAL_RESOURCES/TECHNICAL_LITERATURE/DATASHEET/CD00000444.pdf; Supplier Part Number 1: 497-7255-1-ND

## Nets that join several sheets
GND: LED_Controller (9 pins), LED_Controller_Connectors (10 pins), LED_Controller_Wireless (19 pins), LED_Controller_UART_Multiplexer (14 pins), LED_Controller_Power (10 pins)
V_3.3: LED_Controller (7 pins), LED_Controller_Connectors (PROG_HDR.2 R?.2), LED_Controller_Wireless (13 pins), LED_Controller_UART_Multiplexer (14 pins), LED_Controller_Power (3.3V_REG.1)
V_5_A: LED_Controller_Connectors (P_LED_A.3), LED_Controller_Power (5V_REG_A.3)
V_5_B: LED_Controller_Connectors (P_LED_B.3), LED_Controller_Power (5V_REG_B.3)
V_5_C: LED_Controller_Connectors (P_LED_C.3), LED_Controller_Power (5V_REG_C.3)
V_5_D: LED_Controller_Connectors (P_LED_D.3), LED_Controller_Power (5V_REG_D.3)
V_5_E: LED_Controller_Connectors (P_LED_E.3), LED_Controller_Power (5V_REG_E.3)
V_5_F: LED_Controller_Connectors (P_LED_F.3), LED_Controller_Power (5V_REG_F.3)
V_5_G: LED_Controller_Connectors (P_LED_G.3), LED_Controller_Power (5V_REG_G.3)
V_5_H: LED_Controller_Connectors (P_LED_H.3), LED_Controller_Power (5V_REG_H.3)
CS: LED_Controller (MCU.24), LED_Controller_Wireless (R2.1 RF_TXRX.7)
LED_A_RXD_+: LED_Controller_Connectors (P_LED_A.5), LED_Controller_UART_Multiplexer (LED_ABCD_UART_RX.2 R3.1)
LED_A_RXD_-: LED_Controller_Connectors (P_LED_A.6), LED_Controller_UART_Multiplexer (LED_ABCD_UART_RX.1 R3.2)
LED_A_TXD_+: LED_Controller_Connectors (P_LED_A.1), LED_Controller_UART_Multiplexer (LED_ABCD_UART_TX.15)
LED_A_TXD_-: LED_Controller_Connectors (P_LED_A.2), LED_Controller_UART_Multiplexer (LED_ABCD_UART_TX.16)
LED_B_RXD_+: LED_Controller_Connectors (P_LED_B.5), LED_Controller_UART_Multiplexer (LED_ABCD_UART_RX.3 R4.1)
LED_B_RXD_-: LED_Controller_Connectors (P_LED_B.6), LED_Controller_UART_Multiplexer (LED_ABCD_UART_RX.4 R4.2)
LED_B_TXD_+: LED_Controller_Connectors (P_LED_B.1), LED_Controller_UART_Multiplexer (LED_ABCD_UART_TX.14)
LED_B_TXD_-: LED_Controller_Connectors (P_LED_B.2), LED_Controller_UART_Multiplexer (LED_ABCD_UART_TX.13)
LED_C_RXD_+: LED_Controller_Connectors (P_LED_C.5), LED_Controller_UART_Multiplexer (LED_ABCD_UART_RX.6 R5.1)
LED_C_RXD_-: LED_Controller_Connectors (P_LED_C.6), LED_Controller_UART_Multiplexer (LED_ABCD_UART_RX.5 R5.2)
LED_C_TXD_+: LED_Controller_Connectors (P_LED_C.1), LED_Controller_UART_Multiplexer (LED_ABCD_UART_TX.11)
LED_C_TXD_-: LED_Controller_Connectors (P_LED_C.2), LED_Controller_UART_Multiplexer (LED_ABCD_UART_TX.12)
LED_D_RXD_+: LED_Controller_Connectors (P_LED_D.5), LED_Controller_UART_Multiplexer (LED_ABCD_UART_RX.7 R6.1)
LED_D_RXD_-: LED_Controller_Connectors (P_LED_D.6), LED_Controller_UART_Multiplexer (LED_ABCD_UART_RX.8 R6.2)
LED_D_TXD_+: LED_Controller_Connectors (P_LED_D.1), LED_Controller_UART_Multiplexer (LED_ABCD_UART_TX.10)
LED_D_TXD_-: LED_Controller_Connectors (P_LED_D.2), LED_Controller_UART_Multiplexer (LED_ABCD_UART_TX.9)
LED_E_RXD_+: LED_Controller_Connectors (P_LED_E.5), LED_Controller_UART_Multiplexer (LED_EFGH_UART_RX.2 R7.1)
LED_E_RXD_-: LED_Controller_Connectors (P_LED_E.6), LED_Controller_UART_Multiplexer (LED_EFGH_UART_RX.1 R7.2)
LED_E_TXD_+: LED_Controller_Connectors (P_LED_E.1), LED_Controller_UART_Multiplexer (LED_EFGH_UART_TX.15)
LED_E_TXD_-: LED_Controller_Connectors (P_LED_E.2), LED_Controller_UART_Multiplexer (LED_EFGH_UART_TX.16)
LED_F_RXD_+: LED_Controller_Connectors (P_LED_F.5), LED_Controller_UART_Multiplexer (LED_EFGH_UART_RX.3 R8.1)
LED_F_RXD_-: LED_Controller_Connectors (P_LED_F.6), LED_Controller_UART_Multiplexer (LED_EFGH_UART_RX.4 R8.2)
LED_F_TXD_+: LED_Controller_Connectors (P_LED_F.1), LED_Controller_UART_Multiplexer (LED_EFGH_UART_TX.14)
LED_F_TXD_-: LED_Controller_Connectors (P_LED_F.2), LED_Controller_UART_Multiplexer (LED_EFGH_UART_TX.13)
LED_G_RXD_+: LED_Controller_Connectors (P_LED_G.5), LED_Controller_UART_Multiplexer (LED_EFGH_UART_RX.6 R9.1)
LED_G_RXD_-: LED_Controller_Connectors (P_LED_G.6), LED_Controller_UART_Multiplexer (LED_EFGH_UART_RX.5 R9.2)
LED_G_TXD_+: LED_Controller_Connectors (P_LED_G.1), LED_Controller_UART_Multiplexer (LED_EFGH_UART_TX.11)
LED_G_TXD_-: LED_Controller_Connectors (P_LED_G.2), LED_Controller_UART_Multiplexer (LED_EFGH_UART_TX.12)
LED_H_RXD_+: LED_Controller_Connectors (P_LED_H.5), LED_Controller_UART_Multiplexer (LED_EFGH_UART_RX.7 R10.1)
LED_H_RXD_-: LED_Controller_Connectors (P_LED_H.6), LED_Controller_UART_Multiplexer (LED_EFGH_UART_RX.8 R10.2)
LED_H_TXD_+: LED_Controller_Connectors (P_LED_H.1), LED_Controller_UART_Multiplexer (LED_EFGH_UART_TX.10)
LED_H_TXD_-: LED_Controller_Connectors (P_LED_H.2), LED_Controller_UART_Multiplexer (LED_EFGH_UART_TX.9)
MISO: LED_Controller (MCU.26), LED_Controller_Wireless (RF_TXRX.2)
MOSI: LED_Controller (MCU.25), LED_Controller_Wireless (RF_TXRX.20)
PDI_DATA: LED_Controller (MCU.34), LED_Controller_Connectors (*.4 PROG_HDR.1)
SCLK: LED_Controller (MCU.27), LED_Controller_Wireless (RF_TXRX.1)
UART_C0_RXD: LED_Controller (MCU.12), LED_Controller_UART_Multiplexer (LED_UART_RXD_MULT.4)
UART_C0_TXD: LED_Controller (MCU.13), LED_Controller_UART_Multiplexer (LED_UART_TXD_MULT.4)
UART_C1_RXD: LED_Controller (MCU.16), LED_Controller_UART_Multiplexer (LED_UART_RXD_MULT.7)
UART_C1_TXD: LED_Controller (MCU.17), LED_Controller_UART_Multiplexer (LED_UART_TXD_MULT.7)
UART_D0_RXD: LED_Controller (MCU.22), LED_Controller_UART_Multiplexer (LED_UART_RXD_MULT.16)
UART_D0_TXD: LED_Controller (MCU.23), LED_Controller_UART_Multiplexer (LED_UART_TXD_MULT.16)
UART_E0_RXD: LED_Controller (MCU.32), LED_Controller_UART_Multiplexer (LED_UART_RXD_MULT.13)
UART_E0_TXD: LED_Controller (MCU.33), LED_Controller_UART_Multiplexer (LED_UART_TXD_MULT.13)